# EAGLE schematic ESP32_breakout v3 (EAGLE 7.7.0)
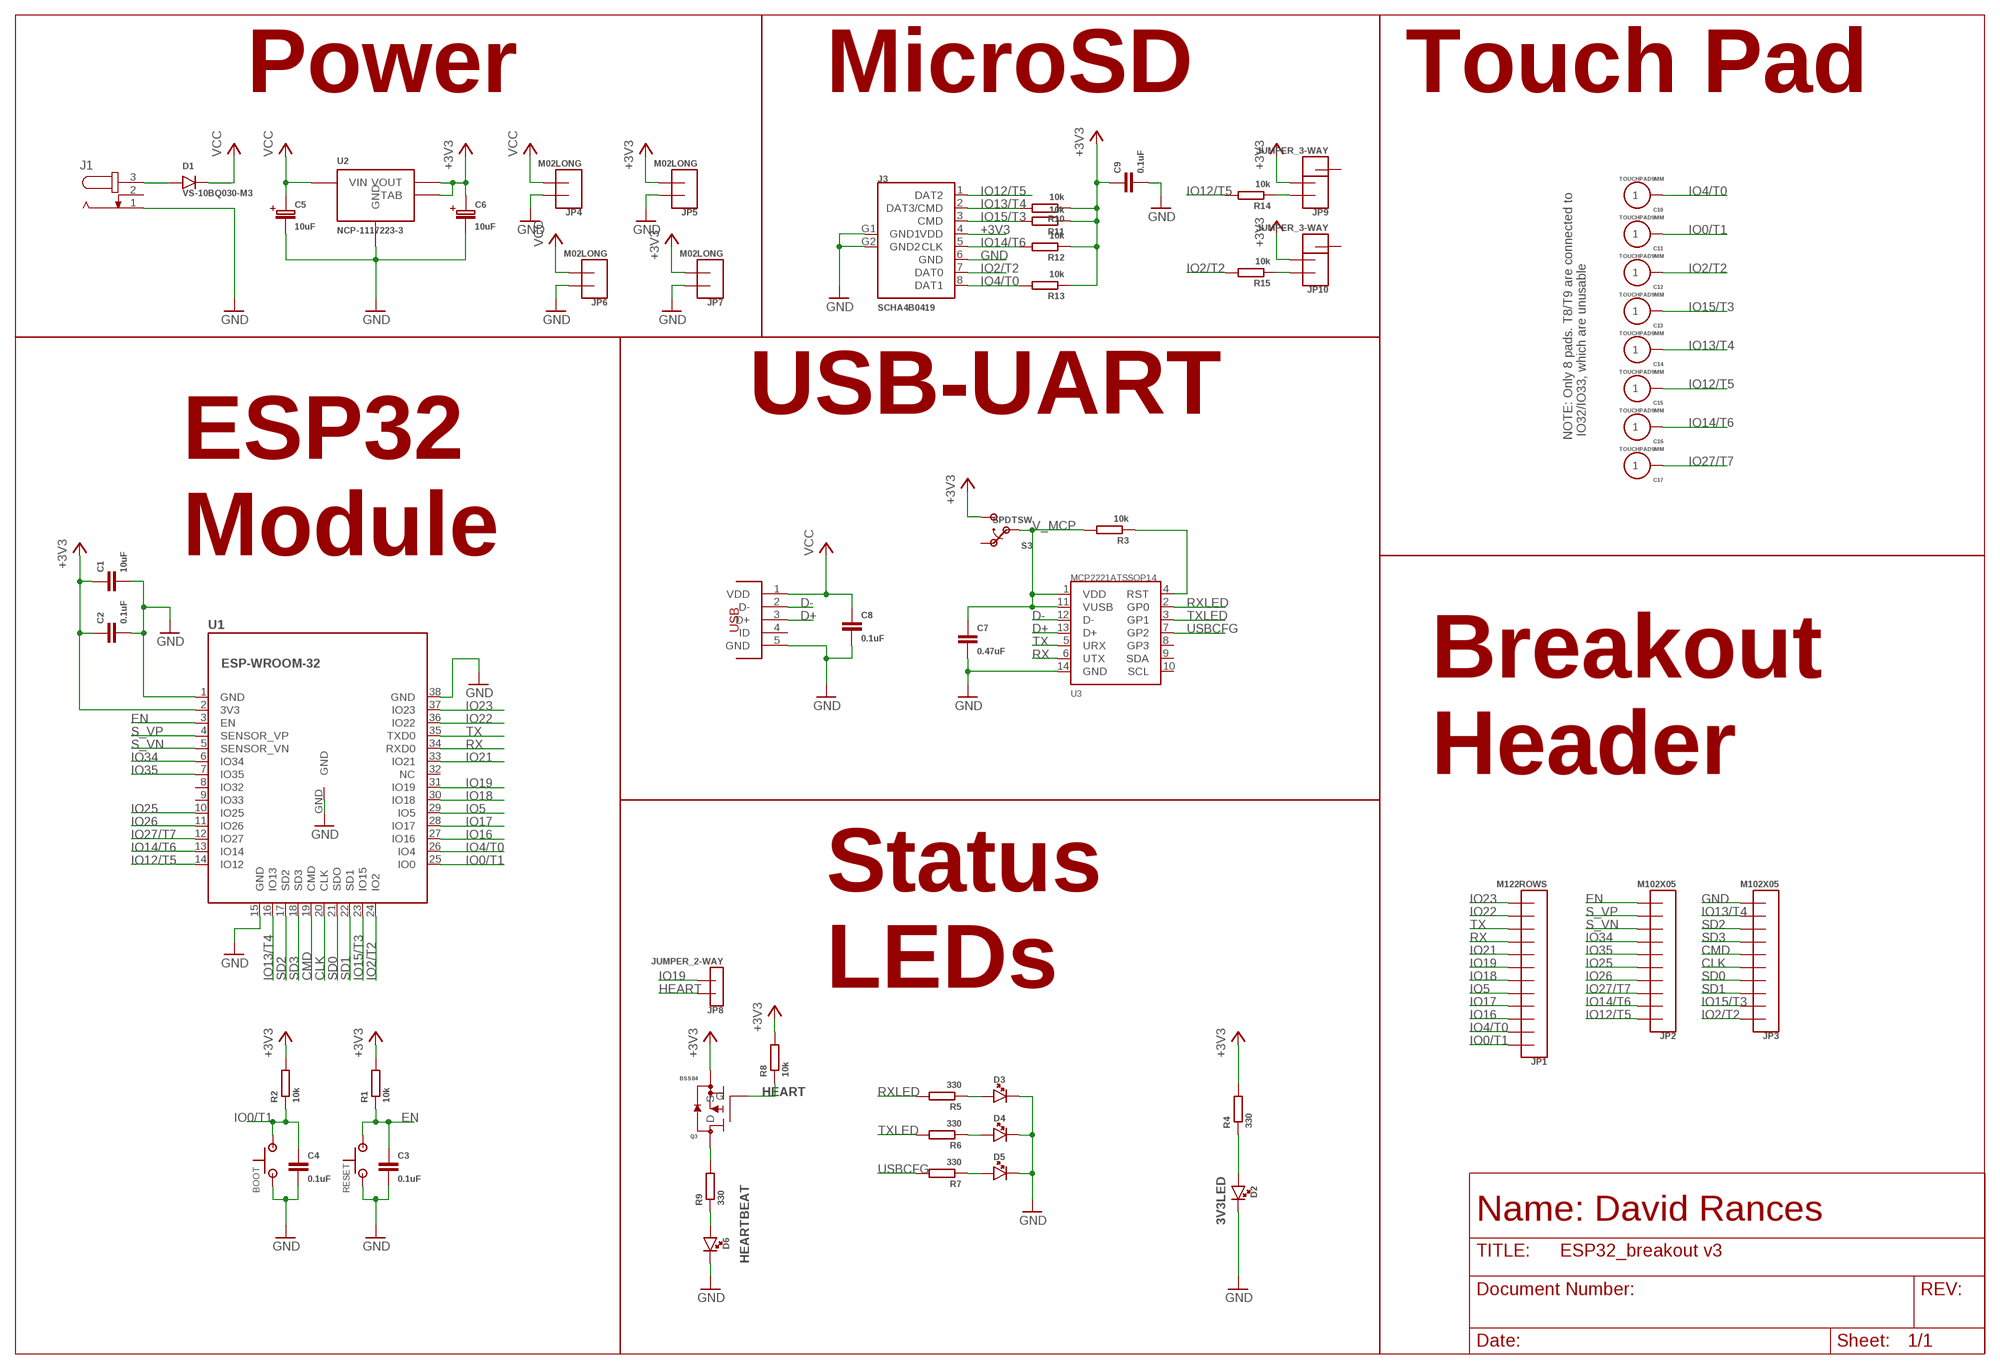
[diagram p0: schematic, sheet 1]

## Parts
BOOT  PUSHBUTTONSKHMQME010  [SKHMQME010]
C1  10uF  CAP0603  [CAP-0603]
C2  0.1uF  CAP0603  [CAP-0603]
C3  0.1uF  CAP0603  [CAP-0603]
C4  0.1uF  CAP0603  [CAP-0603]
C5  10uF  CAP-POLARCASEB-3528  [B-3528]
C6  10uF  CAP-POLARCASEB-3528  [B-3528]
C7  0.47uF  CAP0603  [CAP-0603]
C8  0.1uF  CAP0603  [CAP-0603]
C9  0.1uF  CAP0603  [CAP-0603]
C10  TOUCHPAD9MM  [TOUCH-9MMX9MM]
C11  TOUCHPAD9MM  [TOUCH-9MMX9MM]
C12  TOUCHPAD9MM  [TOUCH-9MMX9MM]
C13  TOUCHPAD9MM  [TOUCH-9MMX9MM]
C14  TOUCHPAD9MM  [TOUCH-9MMX9MM]
C15  TOUCHPAD9MM  [TOUCH-9MMX9MM]
C16  TOUCHPAD9MM  [TOUCH-9MMX9MM]
C17  TOUCHPAD9MM  [TOUCH-9MMX9MM]
D1  VS-10BQ030-M3  [DO-214AA]
D2  LED1206  [LED-1206]
D3  LED1206  [LED-1206]
D4  LED1206  [LED-1206]
D5  LED1206  [LED-1206]
D6  LED1206  [LED-1206]
J1  JACK-PLUG0  [SPC4077]
J3  SCHA4B0419  [MICROSD_SCHA4B0419]
JP1  M122ROWS  [2X06]
JP2  M102X05  [2X05]
JP3  M102X05  [2X05]
JP4  M02LONG  [1X02-LONG]
JP5  M02LONG  [1X02-LONG]
JP6  M02LONG  [1X02-LONG]
JP7  M02LONG  [1X02-LONG]
JP8  JUMPER_2-WAY  [1X02]
JP9  JUMPER_3-WAY  [1X03]
JP10  JUMPER_3-WAY  [1X03]
Q3  BSS84  [SOT-23-3]
R1  10k  RESISTOR0603  [RES-0603]
R2  10k  RESISTOR0603  [RES-0603]
R3  10k  RESISTOR0603  [RES-0603]
R4  330  RESISTOR0603  [RES-0603]
R5  330  RESISTOR0603  [RES-0603]
R6  330  RESISTOR0603  [RES-0603]
R7  330  RESISTOR0603  [RES-0603]
R8  10k  RESISTOR0603  [RES-0603]
R9  330  RESISTOR0603  [RES-0603]
R10  10k  RESISTOR0603  [RES-0603]
R11  10k  RESISTOR0603  [RES-0603]
R12  10k  RESISTOR0603  [RES-0603]
R13  10k  RESISTOR0603  [RES-0603]
R14  10k  RESISTOR0603  [RES-0603]
R15  10k  RESISTOR0603  [RES-0603]
RESET  PUSHBUTTONSKHMQME010  [SKHMQME010]
S3  SPDTSW  [SPDT_TH]
U1  ESP-WROOM-32  [ESP-WROOM-32]
U2  NCP-1117223-3  [SOT-223-3]
U3  MCP2221ATSSOP14  [TSSOP-14]
U$4  MOLEX_USBMICRO  [MOLEX_47346-001]

## Nets
+3V3: C1.1 C2.1 C6.P C9.1 J3.4(VDD) JP5.2 JP7.2 JP9.2 JP10.2 Q3.S R1.2 R2.2 R4.2 R8.2 R10.1 R11.1 R12.1 R13.1 S3.3 U1.2(3V3) U2.2(VOUT) U2.PAD(TAB)
CLK: JP3.5 U1.20(CLK)
CMD: JP3.6 U1.19(CMD)
D+: U3.13(D+) U$4.3(D+)
D-: U3.12(D-) U$4.2(D-)
EN: C3.1 JP2.10 R1.1 RESET.3 RESET.4 U1.3(EN)
GND: BOOT.1 BOOT.2 C1.2 C2.2 C3.2 C4.2 C5.N C6.N C7.2 C8.2 C9.2 D2.C D3.C D4.C D5.C D6.C J1.1 J3.6(GND) J3.G1(GND1) J3.G2(GND2) JP3.10 JP4.1 JP5.1 JP6.1 JP7.1 RESET.1 RESET.2 U1.1(GND) U1.15(GND) U1.38(GND) U1.GND U2.1(GND) U3.14(GND) U$4.5(GND)
HEART: JP8.1 Q3.G R8.1
IO0/T1: BOOT.3 BOOT.4 C4.1 C11.P$1 JP1.1 R2.1 U1.25(IO0)
IO2/T2: C12.P$1 J3.7(DAT0) JP3.1 R15.2 U1.24(IO2)
IO4/T0: C10.P$1 J3.8(DAT1) JP1.2 R13.2 U1.26(IO4)
IO5: JP1.5 U1.29(IO5)
IO12/T5: C15.P$1 J3.1(DAT2) JP2.1 R14.2 U1.14(IO12)
IO13/T4: C14.P$1 J3.2(DAT3/CMD) JP3.9 R10.2 U1.16(IO13)
IO14/T6: C16.P$1 J3.5(CLK) JP2.2 R12.2 U1.13(IO14)
IO15/T3: C13.P$1 J3.3(CMD) JP3.2 R11.2 U1.23(IO15)
IO16: JP1.3 U1.27(IO16)
IO17: JP1.4 U1.28(IO17)
IO18: JP1.6 U1.30(IO18)
IO19: JP1.7 JP8.2 U1.31(IO19)
IO21: JP1.8 U1.33(IO21)
IO22: JP1.11 U1.36(IO22)
IO23: JP1.12 U1.37(IO23)
IO25: JP2.5 U1.10(IO25)
IO26: JP2.4 U1.11(IO26)
IO27/T7: C17.P$1 JP2.3 U1.12(IO27)
IO34: JP2.7 U1.6(IO34)
IO35: JP2.6 U1.7(IO35)
N$2: D1.A J1.3
N$3: R3.1 U3.4(RST)
N$4: D5.A R7.1
N$5: D2.A R4.1
N$6: JP9.1 R14.1
N$7: JP10.1 R15.1
N$8: D3.A R5.1
N$9: D6.A R9.1
N$10: Q3.D R9.2
N$11: D4.A R6.1
RX: JP1.9 U1.34(RXD0) U3.6(UTX)
RXLED: R5.2 U3.2(GP0)
S_VN: JP2.8 U1.5(SENSOR_VN)
S_VP: JP2.9 U1.4(SENSOR_VP)
SD0: JP3.4 U1.21(SDO)
SD1: JP3.3 U1.22(SD1)
SD2: JP3.8 U1.17(SD2)
SD3: JP3.7 U1.18(SD3)
TX: JP1.10 U1.35(TXD0) U3.5(URX)
TXLED: R6.2 U3.3(GP1)
USBCFG: R7.2 U3.7(GP2)
V_MCP: C7.1 R3.2 S3.2(OUT) U3.1(VDD) U3.11(VUSB)
VCC: C5.P C8.1 D1.C JP4.2 JP6.2 U2.3(VIN) U$4.1(VDD)
Unconnected: BOOT.5 J1.2 JP9.3 JP10.3 RESET.5 S3.1 U1.8(IO32) U1.9(IO33) U1.32(NC) U3.8(GP3) U3.9(SDA) U3.10(SCL) U$4.4(ID)

## Notes on the sheet
- Power | MicroSD | Touch Pad
- USB-UART
- NOTE: Only 8 pads. T8/T9 are connected to
   IO32/IO33, which are unusable
- ESP32
  Module
- Breakout
  Header
- Status
  LEDs
- Name: David Rances
- 3V3LED
- HEARTBEAT

## Library data of the parts
BOOT RESET = dr-library:PUSHBUTTON: ALPS Tactile Switch 50mA at 12V Mouser Product # 688-SKHMQME010
C1-C4 C7-C9 = dr-library:CAP: Multilayer Ceramic Capacitor
C5 C6 = dr-library:CAP-POLAR
C10-C17 = dr-library:TOUCHPAD
D1 = dr-library:VS-10BQ030-M3: Vishay Semiconductors High Performance Schottky Rectifier 1.0A Mfg. No. VS-10BQ030-M3/5BT http://www.mouser.com/ds/2/427/vs-10bq030-m3-552919.pdf
D2-D6 = dr-library:LED
J1 = EmbeddedAdventures 3:JACK-PLUG: DC POWER JACK Power Jack, DC, Right Angle, Through Hole, Rated 5A at 16VDC, PC Terminals Distributor: Farnell (www.Farnell.de) Drawing: 84N1161.pdf / 84N1162.pdf Manufacturer: SPC Technology (www.spctechnology.com) Type: SPC4077 / SPC 4078
J3 = dr-library:SCHA4B0419: ALPS MicroSD Connector Manufacturer No. SCHA4B0419 http://www2.mouser.com/ProductDetail/ALPS/SCHA4B0419/?qs=sGAEpiMZZMuJakaoiLiBpsFSICW6cUCj0ci6XSEAGXcTwv1T7afZMw%3d%3d
JP1 = dr-library:M12
JP2 JP3 = dr-library:M10
JP4-JP7 = dr-library:M02
JP8 = dr-library:JUMPER_2-WAY
JP9 JP10 = dr-library:JUMPER_3-WAY
Q3 = dr-library:BSS84: Fairchild Semiconductor P-Channel Enhancement Mode MOSFET Mfg. No. BSS84 Mouser No. 512-BSS84 http://www.mouser.com/ds/2/149/BSS84-1006729.pdf
R1-R15 = dr-library:RESISTOR
S3 = dr-library:SPDT
U1 = dr-library:ESP-WROOM-32
U2 = dr-library:NCP-1117: ON Semiconductor Low Dropout Positive Voltage Regulator 1A output Datasheet: http://www.mouser.com/ds/2/308/NCP1117LP-D-82673.pdf
U3 = dr-library:MCP2221A: MCP2221A USB 2.0 to I2C/UART Protocol Converter with GPIO Microchip http://ww1.microchip.com/downloads/en/DeviceDoc/20005565B.pdf Mouser Part #579-MCP2221A-I/ST
U$4 = dr-library:MOLEX_USBMICRO